# EAGLE design H_V2 (EAGLE 4.13)
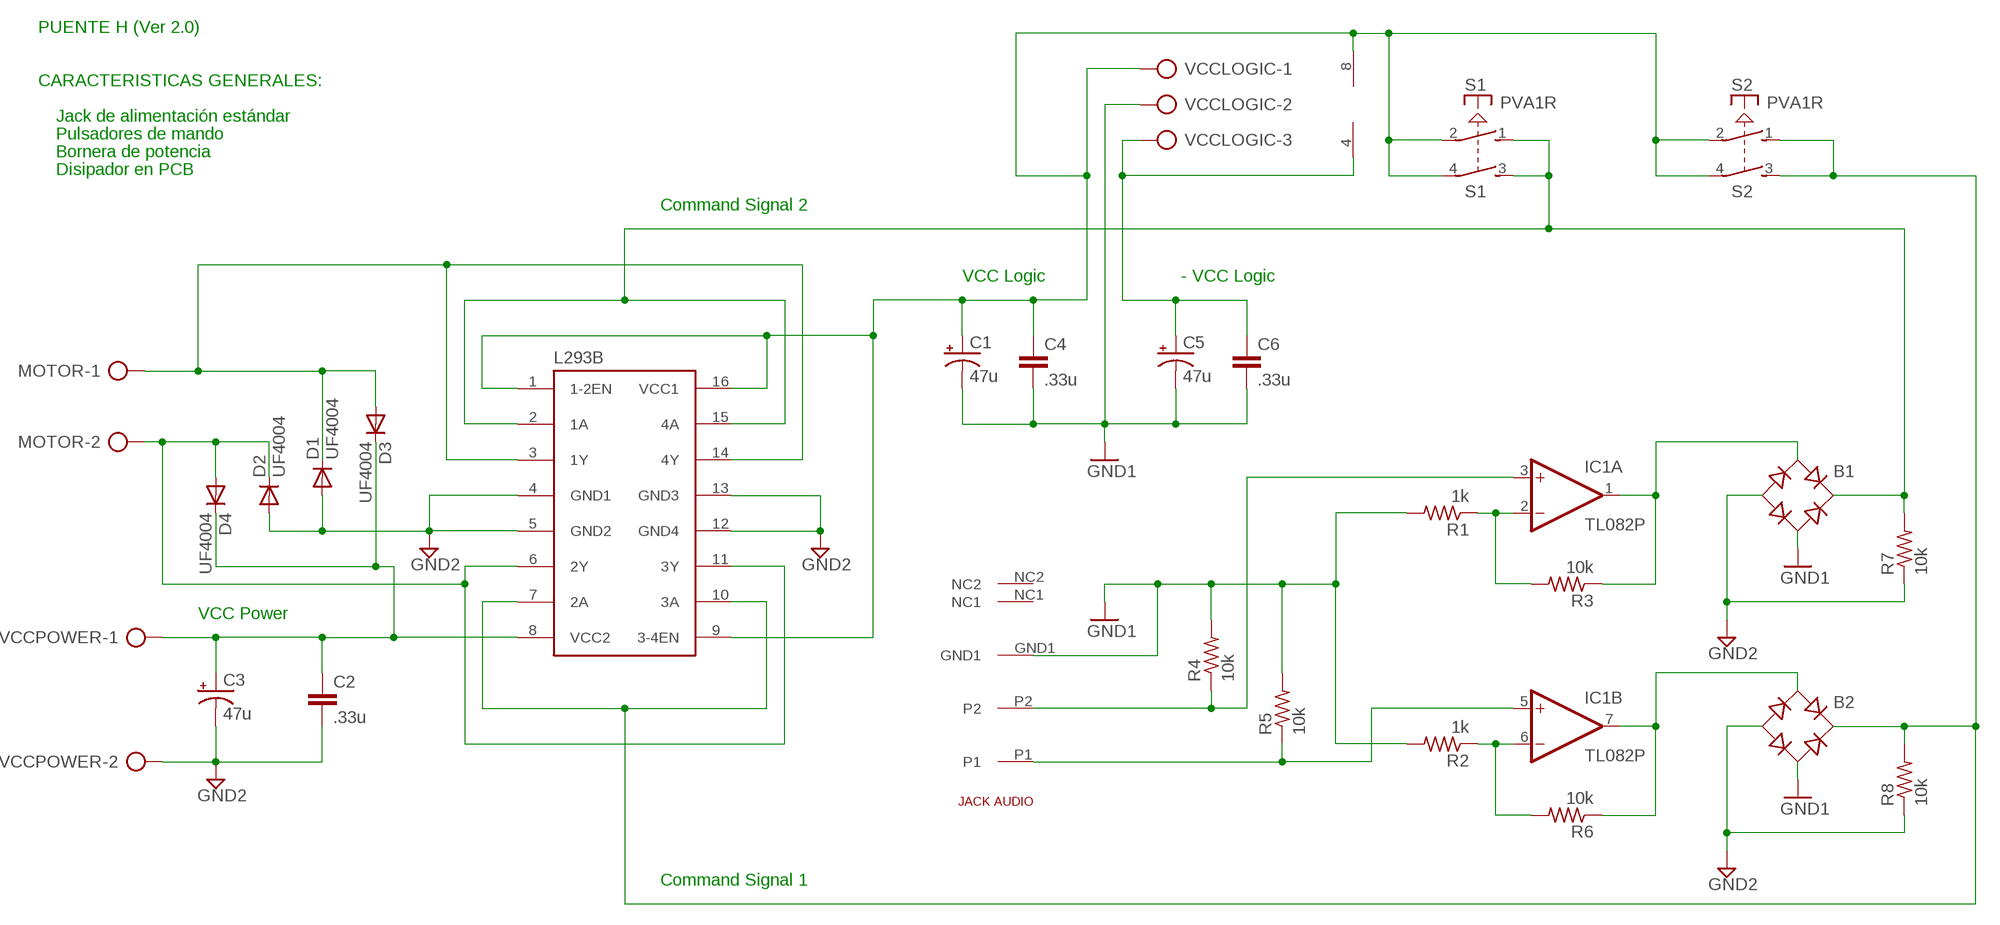
[diagram p0: schematic, sheet 1]

## Parts
B1  RB1A  [RB1A]
B2  RB1A  [RB1A]
C1  47u  CPOL-USE3.5-8  [E3,5-8]
C2  .33u  C2,5-3  [C2.5-3]
C3  47u  CPOL-USE3.5-8  [E3,5-8]
C4  .33u  C2,5-3  [C2.5-3]
C5  47u  CPOL-USE3.5-8  [E3,5-8]
C6  .33u  C2,5-3  [C2.5-3]
D1  UF4004  1N4004  [DO41-10]
D2  UF4004  1N4004  [DO41-10]
D3  UF4004  1N4004  [DO41-10]
D4  UF4004  1N4004  [DO41-10]
IC1  TL082P  [DIL08]
JACKAUDIO1  JACKAUDIO  [ZOCALOGUS]
L293B  L293E  [DIL16]
MOTOR  AK300/2  [AK300/2]
R1  1k  R-US_0207/12  [0207/12]
R2  1k  R-US_0207/12  [0207/12]
R3  10k  R-US_0207/12  [0207/12]
R4  10k  R-US_0207/12  [0207/12]
R5  10k  R-US_0207/12  [0207/12]
R6  10k  R-US_0207/12  [0207/12]
R7  10k  R-US_0207/12  [0207/12]
R8  10k  R-US_0207/12  [0207/12]
S1  PVA1R  [PVA1R]
S2  PVA1R  [PVA1R]
VCCLOGIC  AK500/3  [AK500/3]
VCCPOWER  AK300/2  [AK300/2]

## Nets
AGND: B2.- C2.2 C3.- D1.A D2.A L293B.4(GND1) L293B.5(GND2) L293B.12(GND4) L293B.13(GND3) R8.1 VCCPOWER.2 ; supply symbol labelled GND2
GND1: B1.AC2 B2.AC2 C1.- C4.2 C5.- C6.2 JACKAUDIO1.GND1 R1.2 R2.2 R4.2 R5.2 VCCLOGIC.2
GND2: B1.- R7.1
N$1: B2.+ L293B.7(2A) L293B.10(3A) R8.2 S2.1(1:S) S2.3(2:S)
N$2: B1.+ L293B.2(1A) L293B.15(4A) R7.2 S1.1(1:S) S1.3(2:S)
N$5: C1.+ C4.1 IC1.8(P:V+) L293B.1(1-2EN) L293B.9(3-4EN) L293B.16(VCC1) S1.2(1:P) S1.4(2:P) S2.2(1:P) S2.4(2:P) VCCLOGIC.1
N$6: IC1.5(B:+IN) JACKAUDIO1.P1 R5.1
N$7: IC1.3(A:+IN) JACKAUDIO1.P2 R4.1
N$8: C2.1 C3.+ D3.C D4.C L293B.8(VCC2) VCCPOWER.1
N$9: IC1.2(A:-IN) R1.1 R3.2
N$10: D2.C D4.A L293B.6(2Y) L293B.11(3Y) MOTOR.2
N$11: D1.C D3.A L293B.3(1Y) L293B.14(4Y) MOTOR.1
N$12: IC1.6(B:-IN) R2.1 R6.2
N$14: C5.+ C6.1 IC1.4(P:V-) VCCLOGIC.3
N$16: B1.AC1 IC1.1(A:OUT) R3.1
N$17: B2.AC1 IC1.7(B:OUT) R6.1
Unconnected: JACKAUDIO1.NC1 JACKAUDIO1.NC2

## Notes on the sheet
- PUENTE H (Ver 2.0)
- CARACTERISTICAS GENERALES:
- Jack de alimentación estándar
- Pulsadores de mando
- Bornera de potencia
- Disipador en PCB
- Command Signal 2
- VCC Logic | - VCC Logic
- VCC Power
- Command Signal 1

## Library data of the parts
B1 B2 = rectifier:RB1A: RECTIFIER 1 A
C1 C3 C5 = rcl:CPOL-US: POLARIZED CAPACITOR, American symbol
C2 C4 C6 = capacitor-wima:C: CAPACITOR naming: grid - package width
D1-D4 = diode:1N4004: DIODE general purpose rectifier, 1 A
IC1 = linear:TL082: OP AMP
JACKAUDIO1 = con-gus:JACKAUDIO
L293B = texas:L293E: TI DEVICE
MOTOR VCCPOWER = con-ptr500:AK300/2: CONNECTOR
R1-R8 = rcl:R-US_: RESISTOR, American symbol
S1 S2 = switch-misc:PVA1R: ITT SWITCH
VCCLOGIC = con-ptr500:AK500/3: CONNECTOR

## Board
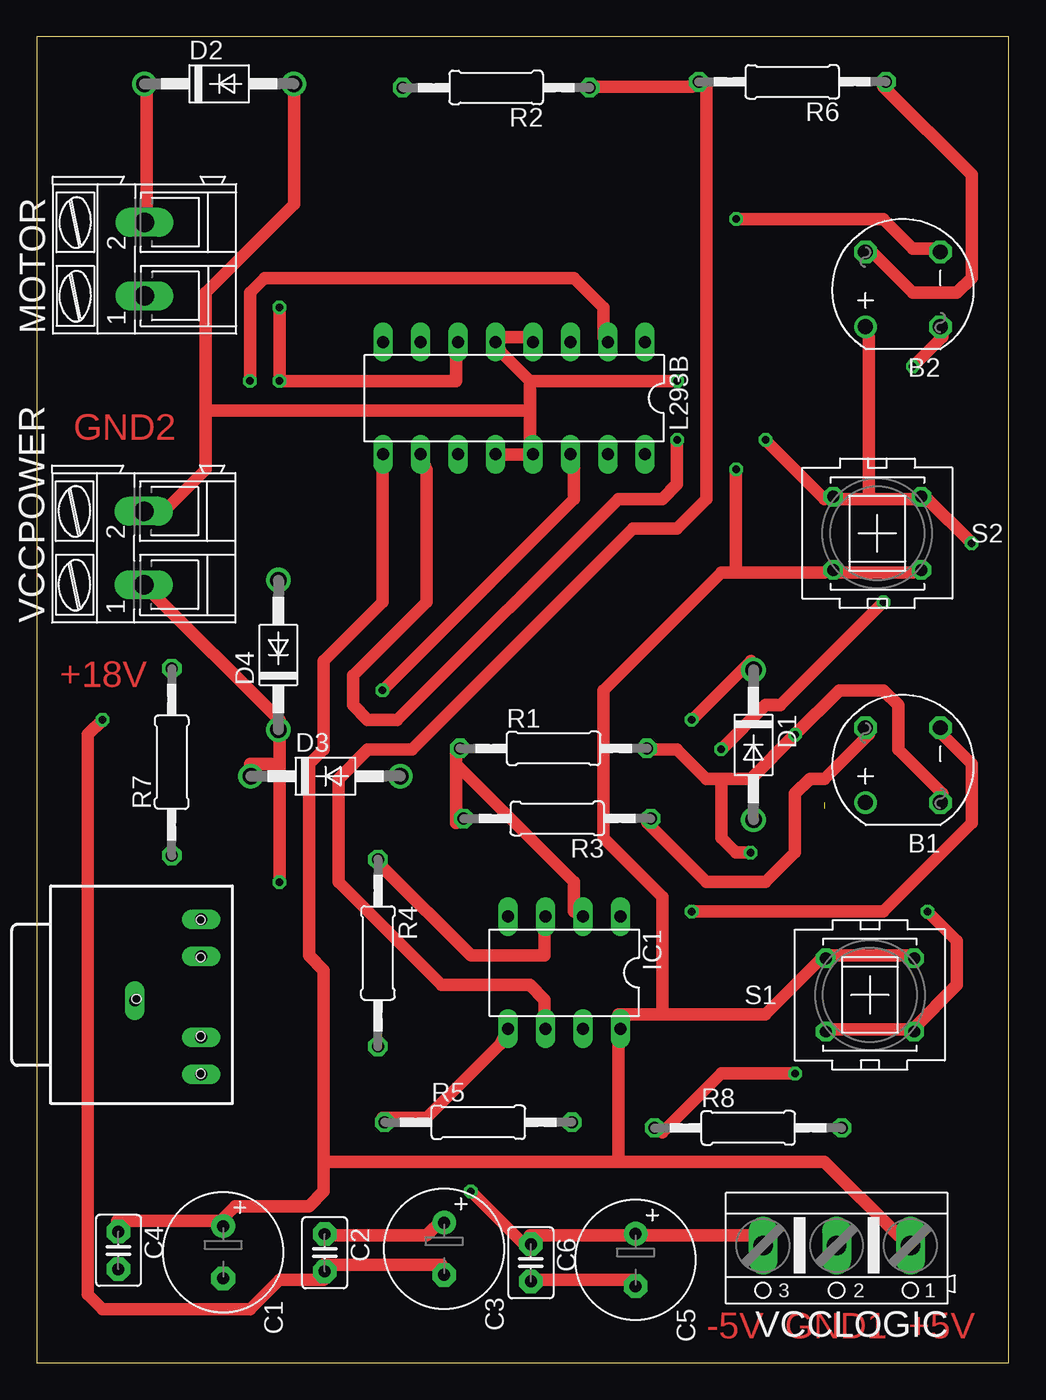
[diagram p1: board, top side]
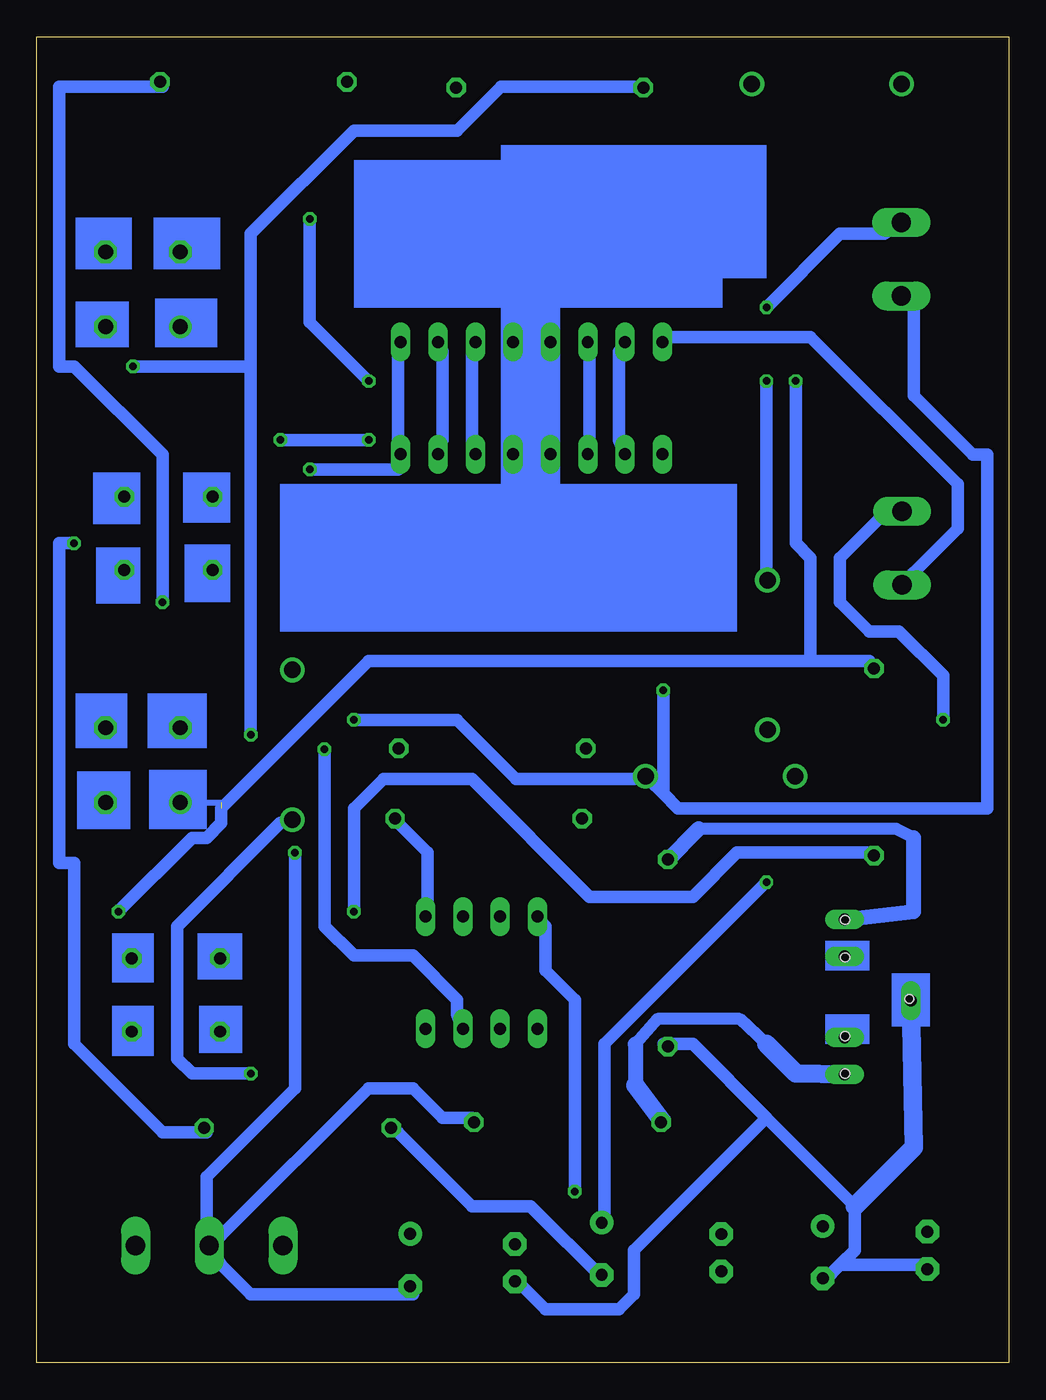
[diagram p2: board, bottom side, seen from below]

Size 66 x 90 mm. Coordinates in mm from the lower left corner, seen from the top.
Outline: 0,0 66,0 66,90 0,90 0,0
Copper layers (1*16): Top 0.035mm / dielectric 1.5mm / Bottom 0.035mm
Design rules "default": minimum track width 33mil, minimum drill 20mil, track to track 33mil, track to pad 33mil, pad to pad 33mil, via to via 33mil, smd to smd 33mil, copper to edge 40mil, drill to drill 8mil, minimum pad ring 10mil, minimum via ring 8mil, stop-mask expansion 4mil, vias tented up to drill 0mil, thermal gap 10mil

### Footprints (pad centres in the part's own frame; a part is rotated, then mirrored left to right if it is on the bottom)
RB1A = drill 1.016 round: + -2.54,2.54 | drill 1.016 octagon: - 2.54,-2.54; AC1 2.54,2.54; AC2 -2.54,-2.54
E3,5-8 = drill 0.813 pad 1.6 round: + -1.778,0 | drill 0.813 pad 1.6 octagon: - 1.778,0
C2.5-3 = drill 0.813 pad 1.6 octagon: 1 -1.27,0; 2 1.27,0
DO41-10 = drill 1.118 round: A 5.08,0; C -5.08,0
DIL08 = drill 0.813 long: 1 -3.81,-3.81; 2 -1.27,-3.81; 3 1.27,-3.81; 4 3.81,-3.81; 5 3.81,3.81; 6 1.27,3.81; 7 -1.27,3.81; 8 -3.81,3.81
ZOCALOGUS = drill 0.8 long: GND1 7.5,7; NC1 5,2.5; NC2 10.5,2.5; P1 2.5,2.5; P2 13,2.5 | hole 0.6: 2.54,2.54; 12.97,2.54; 5.08,2.54; 10.43,2.54; 7.62,6.89
DIL16 = drill 0.813 long: 1 -8.89,-3.81; 2 -6.35,-3.81; 3 -3.81,-3.81; 4 -1.27,-3.81; 5 1.27,-3.81; 6 3.81,-3.81; 7 6.35,-3.81; 8 8.89,-3.81; 9 8.89,3.81; 10 6.35,3.81; 11 3.81,3.81; 12 1.27,3.81; 13 -1.27,3.81; 14 -3.81,3.81; 15 -6.35,3.81; 16 -8.89,3.81
AK300/2 = drill 1.321 long: 1 -2.515,0; 2 2.489,0
0207/12 = drill 0.813 octagon: 1 -6.35,0; 2 6.35,0
PVA1R = drill 0.813 octagon: 1 -2.997,2.489; 2 -2.997,-2.489; 3 2.997,2.489; 4 2.997,-2.489
AK500/3 = drill 1.321 long: 1 -5.004,0; 2 0,0; 3 5.004,0

### Placement (x,y rotation side)
B1  58.8,40.56 90 top
B2  58.8,72.86 90 top
C1  12.65,7.49 270 top
C2  19.54,7.46 270 top
C3  27.65,7.73 270 top
C4  5.54,7.62 270 top
C5  40.65,6.97 270 top
C6  33.54,6.78 270 top
D1  48.65,41.94 270 top
D2  12.38,86.81 0 top
D3  19.6,39.81 0 top
D4  16.4,48.04 90 top
IC1  35.81,26.47 180 top
JACKAUDIO1  13.66,17.08 90 top
L293B  32.41,65.47 180 top
MOTOR  7.31,74.92 90 top
R1  35.08,41.7 0 top
R2  31.18,86.56 180 top
R3  35.33,36.94 180 top
R4  23.16,27.81 270 top
R5  29.97,16.32 0 top
R6  51.29,86.94 180 top
R7  9.16,40.77 90 top
R8  48.29,15.94 0 top
S1  56.56,24.96 180 top
S2  57.06,56.3 0 top
VCCLOGIC  54.3,7.96 180 top
VCCPOWER  7.26,55.31 90 top

### Tracks (layer width: path | path; a pad name or v marks a point on that pad's centre or on a via)
AGND  (via drill 0.51)
  Top 0.838: C3.- 27.47,6.63 19.47,6.63 C2.2 19.47,5.63 16.47,5.63 14.47,3.63 4.47,3.63 3.47,4.63 3.47,42.63 v4.47,43.63 | v51.47,19.63 46.47,19.63 42.47,15.63 R8.1 | 11.47,64.63 11.47,60.63 8.47,57.63 VCCPOWER.2 | 11.47,64.63 11.47,72.63 17.47,78.63 17.47,86.63 D2.A | L293B.12 31.47,61.63 33.47,61.63 L293B.13 33.47,62.63 33.47,64.63 | L293B.4 33.47,69.63 31.47,69.63 L293B.5 31.47,68.63 33.47,66.63 | v47.47,77.63 57.47,77.63 59.47,75.63 61.47,75.63 B2.- | 33.47,66.63 v43.47,66.63 | 33.47,64.63 33.47,66.63 | 11.47,64.63 33.47,64.63
  Bottom 0.838: R8.1 41.47,15.63 36.47,10.63 32.47,10.63 27.47,5.63 C3.- | v51.47,19.63 55.47,19.63 56.47,20.63 56.47,29.63 49.47,36.63 D1.A | v47.47,77.63 47.47,70.63 v43.47,66.63 | v4.47,43.63 4.47,46.63 7.47,49.63 9.47,49.63 11.47,51.63 11.47,54.63 8.47,57.63 VCCPOWER.2
GND1  (via drill 0.51)
  Top 0.838: C6.2 33.47,5.63 40.47,5.63 C5.- | 46.47,39.63 48.47,39.63 v51.47,42.63 54.47,45.63 57.47,45.63 58.47,44.63 58.47,41.63 61.47,38.63 B1.AC2 | 46.47,39.63 45.47,39.63 43.47,41.63 41.47,41.63 R1.2 | v59.47,67.63 61.47,69.63 B2.AC2 | v48.47,34.63 47.47,34.63 46.47,35.63 46.47,39.63
  Bottom 0.838: 16.47,16.63 10.47,10.63 10.47,7.63 11.47,6.63 | 16.47,16.63 21.47,21.63 23.47,21.63 R4.2 | 11.47,6.63 12.47,5.63 C1.- | 11.47,6.63 5.47,6.63 C4.2 | R5.2 36.47,16.63 38.47,16.63 40.47,18.63 43.47,18.63 53.47,8.63 VCCLOGIC.2 | C5.- 40.47,4.63 51.47,4.63 53.47,6.63 VCCLOGIC.2 | 16.47,16.63 25.47,7.63 25.47,4.63 26.47,3.63 31.47,3.63 33.47,5.63 C6.2 | v51.47,42.63 51.47,67.63 | 51.47,67.63 51.47,76.63 44.47,83.63 37.47,83.63 34.47,86.63 25.47,86.63 R2.2 | 51.47,67.63 v59.47,67.63 | v48.47,34.63 48.47,18.63 54.47,12.63 54.47,9.63 VCCLOGIC.2
  Bottom 1.27: JACKAUDIO1.GND1 6.47,14.63 10.47,10.63
GND2  (via drill 0.51)
  Top 0.838: v44.47,30.63 57.47,30.63 63.47,36.63 63.47,40.63 61.47,42.63 B1.-
  Bottom 0.838: v44.47,30.63 44.47,37.63 42.47,39.63 36.47,39.63 28.47,31.63 21.47,31.63 18.47,34.63 9.47,34.63 R7.1
N$1  (via drill 0.51)
  Top 0.838: v63.47,55.63 60.47,58.63 S2.3 59.47,58.63 56.47,58.63 | 56.47,58.63 54.47,58.63 S2.1 53.47,58.63 v49.47,62.63 | 56.47,58.63 56.47,69.63 B2.+ | v43.47,62.63 43.47,59.63 42.47,58.63 39.47,58.63 24.47,43.63 22.47,43.63 21.47,44.63 21.47,46.63 26.47,51.63 26.47,60.63 L293B.10
  Bottom 0.838: L293B.10 26.47,62.63 26.47,68.63 L293B.7 | v63.47,55.63 64.47,55.63 64.47,33.93 63.47,33.93 63.47,21.63 57.47,15.63 54.47,15.63 R8.2 | v43.47,62.63 v49.47,62.63
N$2  (via drill 0.51)  (2 unrouted)
  Top 0.838: 59.47,22.63 53.47,22.63 S1.3 | 59.47,22.63 62.47,25.63 62.47,28.63 v60.47,30.63 | 59.47,22.63 S1.1 | v14.47,66.63 14.47,72.63 15.47,73.63 36.47,73.63 38.47,71.63 38.47,69.63 L293B.2
  Bottom 0.406: B1.+ 53.47,38.02
  Bottom 0.838: L293B.15 38.47,62.63 38.47,68.63 L293B.2 | 13.47,47.63 43.47,47.63 53.47,37.63 53.47,36.63 54.47,35.63 55.47,35.63 v60.47,30.63 | 13.47,47.63 9.47,47.63 R7.2 | v14.47,66.63 14.47,55.63 13.47,54.63 13.47,47.63
N$5  (via drill 0.51)
  Top 0.838: S2.4 59.47,53.63 54.47,53.63 S2.2 53.47,53.63 47.47,53.63 | 42.47,23.63 49.47,23.63 53.47,27.63 | 42.47,23.63 39.47,23.63 IC1.8 39.47,21.63 39.47,13.63 | 53.47,27.63 59.47,27.63 S1.2 | 53.47,27.63 S1.4 | 47.47,53.63 46.47,53.63 38.47,45.63 38.47,35.63 42.47,31.63 42.47,23.63 | 47.47,53.63 v47.47,60.63 | 19.47,13.63 19.47,11.63 18.47,10.63 13.47,10.63 12.47,9.63 | 19.47,13.63 19.47,26.63 18.47,27.63 18.47,40.63 19.47,41.63 19.47,47.63 23.47,51.63 23.47,60.63 L293B.9 | 12.47,9.63 5.47,9.63 C4.1 | 12.47,9.63 C1.+ | 19.47,13.63 39.47,13.63 | 39.47,13.63 53.47,13.63 58.47,8.63 VCCLOGIC.1
  Bottom 0.838: L293B.1 41.47,68.63 41.47,62.63 L293B.16 41.47,60.63 v47.47,60.63
N$6
  Top 0.838: R5.1 23.47,16.63 26.47,16.63 31.47,21.63 IC1.5
  Bottom 0.813: 16.47,21.63 18.27,23.33 23.87,23.33 25.37,21.63
  Bottom 1.016: 25.37,21.63 25.37,18.83
  Bottom 1.27: JACKAUDIO1.P1 14.47,19.63 16.47,21.63 | R5.1 23.57,16.43 25.37,18.83
N$7
  Top 0.838: R4.1 23.47,33.63 29.47,27.63 34.47,27.63 34.47,29.63 IC1.3
  Bottom 0.813: 6.47,35.63 7.67,36.23 21.07,36.23
  Bottom 1.016: JACKAUDIO1.P2 6.47,30.63 6.47,35.63 | R4.1 23.27,34.03 21.07,36.23
N$8  (via drill 0.51)
  Top 0.838: C2.1 19.47,8.63 26.47,8.63 27.47,9.63 C3.+ | VCCPOWER.1 7.47,52.63 16.47,43.63 D4.C 16.47,42.63 16.47,40.63 | v16.47,32.63 16.47,40.63 | 16.47,40.63 14.47,40.63 D3.C
  Bottom 0.838: L293B.8 23.47,69.63 13.47,69.63 3.47,59.63 3.47,56.63 6.47,53.63 VCCPOWER.1 | v16.47,32.63 27.47,21.63 27.47,9.63 C3.+
N$9
  Top 0.838: 28.47,40.63 28.47,36.63 R3.2 | 28.47,40.63 28.47,41.63 R1.1 | 28.47,40.63 36.47,32.63 36.47,30.63 IC1.2
N$10  (via drill 0.51)
  Top 0.838: D2.C 7.47,86.63 7.47,77.63 MOTOR.2 | L293B.6 28.47,68.63 28.47,66.63 v16.47,66.63 v16.47,71.63
  Bottom 0.838: L293B.11 28.47,62.63 28.47,68.63 L293B.6 | v16.47,66.63 16.47,53.63 D4.A | v16.47,71.63 11.47,76.63 8.47,76.63 MOTOR.2
N$11  (via drill 0.51)
  Top 0.838: v44.47,43.63 48.47,47.63 D1.C | v23.47,45.63 36.47,58.63 36.47,60.63 L293B.14
  Bottom 0.838: L293B.14 36.47,62.63 36.47,68.63 L293B.3 | v44.47,43.63 37.47,43.63 33.47,39.63 25.47,39.63 D3.A 24.47,39.63 23.47,38.63 | 23.47,38.63 22.47,37.63 1.47,37.63 1.47,61.63 2.47,61.63 6.47,65.63 6.47,71.63 MOTOR.1 | 23.47,38.63 v23.47,45.63
N$12
  Top 0.838: IC1.6 34.47,23.63 34.47,24.63 33.47,25.63 27.47,25.63 20.47,32.63 20.47,39.63 22.47,41.63 25.47,41.63 40.47,56.63 43.47,56.63 45.47,58.63 45.47,86.63 R6.2 44.47,86.63 37.47,86.63 R2.1
N$14  (via drill 0.51)
  Top 0.838: v29.47,11.63 33.47,7.63 C6.1 33.47,8.63 40.47,8.63 | 40.47,8.63 48.47,8.63 VCCLOGIC.3 | 40.47,8.63 C5.+
  Bottom 0.838: v29.47,11.63 29.47,24.63 31.47,26.63 31.47,29.63 IC1.4
N$16
  Top 0.838: B1.AC1 56.47,42.63 53.47,39.63 52.47,39.63 51.47,38.63 51.47,34.63 49.47,32.63 45.47,32.63 41.47,36.63 R3.1
  Bottom 0.838: IC1.1 39.47,30.63 39.47,34.63 41.47,36.63 R3.1
N$17  (via drill 0.51)
  Top 0.838: v46.47,41.63 49.47,44.63 50.47,44.63 v57.47,51.63 | B2.AC1 56.47,75.63 59.47,72.63 62.47,72.63 63.47,73.63 63.47,80.63 57.47,86.63 R6.1
  Bottom 0.838: v46.47,41.63 46.47,29.63 44.47,27.63 40.47,27.63 37.47,24.63 37.47,23.63 IC1.7 | v57.47,51.63 57.47,61.63 63.47,67.63 64.47,67.63 64.47,86.63 57.47,86.63 R6.1
(copper drawn outside any net)
  shapes: Bottom area x27, Bottom circle x16

### Text on the board
Top: GND2 | +18V | -5V GND1 +5V